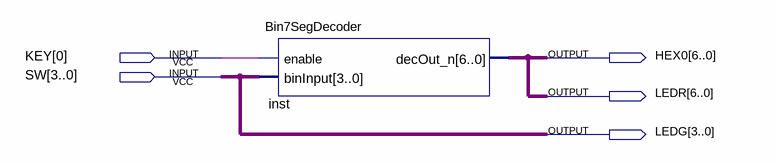
[diagram p0: schematic sheet]
// Quartus schematic DisplayDemoEn.bdf as structural Verilog: 1 symbols, 5 pins
module DisplayDemoEn (
  input  [0:0] KEY,
  input  [3:0] SW,
  output [6:0] HEX0,
  output [6:0] LEDR,
  output [3:0] LEDG
);

  Bin7SegDecoder inst (.enable(KEY[0]), .binInput(SW), .decOut_n(HEX0));

  assign LEDG = SW;
  assign LEDR = HEX0;
endmodule
